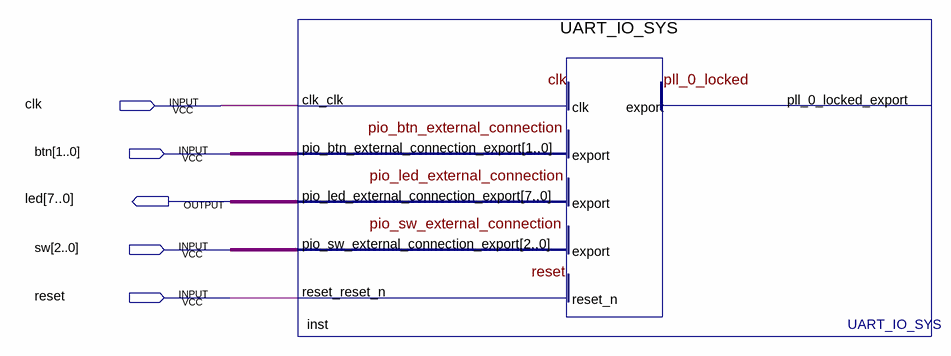
[diagram p0: schematic sheet]
// Quartus schematic UART_IO_2.bdf as structural Verilog: 1 symbols, 5 pins
module UART_IO_2 (
  input  clk,
  input  [1:0] btn,
  input  [2:0] sw,
  input  reset,
  output [7:0] led
);

  UART_IO_SYS inst (
    .clk_clk(clk), .pio_btn_external_connection_export(btn), .pio_sw_external_connection_export(sw),
    .reset_reset_n(reset), .pio_led_external_connection_export(led));  // open: pll_0_locked_export
endmodule
